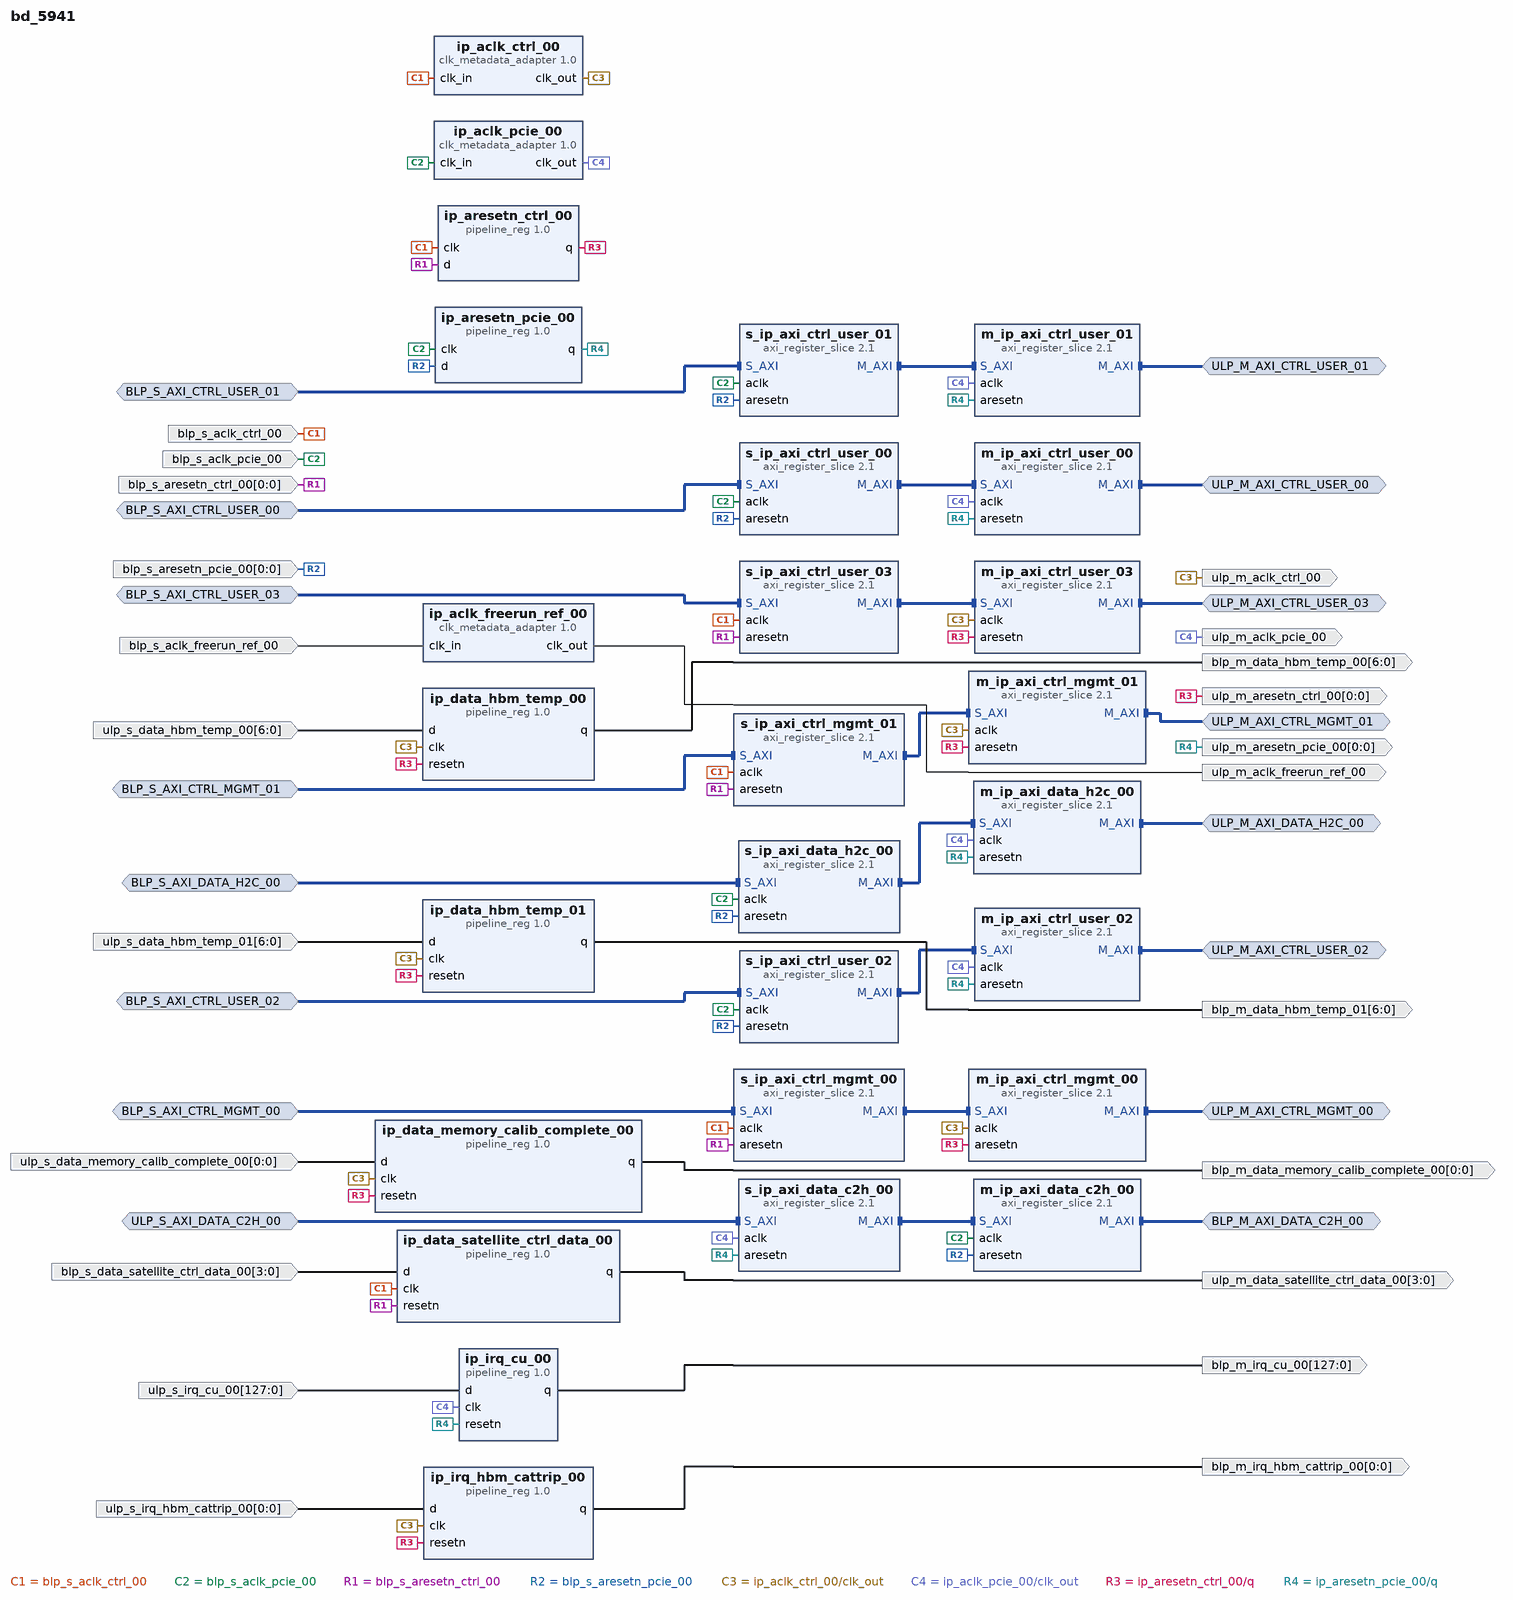
[diagram p0: block diagram of the top level]
# Vivado block design bd_5941, xcu55c-fsvh2892-2L-e, Vivado 2023.2
create_bd_design bd_5941

create_bd_intf_port -mode Slave -vlnv xilinx.com:interface:aximm_rtl:1.0 BLP_S_AXI_CTRL_MGMT_00
set_property -dict [list \
  CONFIG.ADDR_WIDTH 25 \
  CONFIG.ARUSER_WIDTH 0 \
  CONFIG.AWUSER_WIDTH 0 \
  CONFIG.BUSER_WIDTH 0 \
  CONFIG.CLK_DOMAIN cd_ctrl_00 \
  CONFIG.DATA_WIDTH 32 \
  CONFIG.FREQ_HZ 50000000 \
  CONFIG.NUM_READ_OUTSTANDING 2 \
  CONFIG.NUM_WRITE_OUTSTANDING 2 \
  CONFIG.PHASE 0 \
  CONFIG.PROTOCOL AXI4LITE \
  CONFIG.READ_WRITE_MODE READ_WRITE \
  CONFIG.RUSER_WIDTH 0 \
  CONFIG.SLR_ASSIGNMENT slr0 \
  CONFIG.WUSER_WIDTH 0 \
] [get_bd_intf_ports BLP_S_AXI_CTRL_MGMT_00]
create_bd_intf_port -mode Master -vlnv xilinx.com:interface:aximm_rtl:1.0 ULP_M_AXI_CTRL_MGMT_00
set_property -dict [list \
  CONFIG.ADDR_WIDTH 25 \
  CONFIG.ARUSER_WIDTH 0 \
  CONFIG.AWUSER_WIDTH 0 \
  CONFIG.BUSER_WIDTH 0 \
  CONFIG.CLK_DOMAIN cd_ctrl_00 \
  CONFIG.DATA_WIDTH 32 \
  CONFIG.FREQ_HZ 50000000 \
  CONFIG.NUM_READ_OUTSTANDING 2 \
  CONFIG.NUM_WRITE_OUTSTANDING 2 \
  CONFIG.PHASE 0 \
  CONFIG.PROTOCOL AXI4LITE \
  CONFIG.READ_WRITE_MODE READ_WRITE \
  CONFIG.RUSER_WIDTH 0 \
  CONFIG.SLR_ASSIGNMENT slr0 \
  CONFIG.WUSER_WIDTH 0 \
] [get_bd_intf_ports ULP_M_AXI_CTRL_MGMT_00]
create_bd_intf_port -mode Slave -vlnv xilinx.com:interface:aximm_rtl:1.0 BLP_S_AXI_CTRL_MGMT_01
set_property -dict [list \
  CONFIG.ADDR_WIDTH 25 \
  CONFIG.ARUSER_WIDTH 0 \
  CONFIG.AWUSER_WIDTH 0 \
  CONFIG.BUSER_WIDTH 0 \
  CONFIG.CLK_DOMAIN cd_ctrl_00 \
  CONFIG.DATA_WIDTH 32 \
  CONFIG.FREQ_HZ 50000000 \
  CONFIG.NUM_READ_OUTSTANDING 2 \
  CONFIG.NUM_WRITE_OUTSTANDING 2 \
  CONFIG.PHASE 0 \
  CONFIG.PROTOCOL AXI4LITE \
  CONFIG.READ_WRITE_MODE READ_WRITE \
  CONFIG.RUSER_WIDTH 0 \
  CONFIG.SLR_ASSIGNMENT slr2 \
  CONFIG.WUSER_WIDTH 0 \
] [get_bd_intf_ports BLP_S_AXI_CTRL_MGMT_01]
create_bd_intf_port -mode Master -vlnv xilinx.com:interface:aximm_rtl:1.0 ULP_M_AXI_CTRL_MGMT_01
set_property -dict [list \
  CONFIG.ADDR_WIDTH 25 \
  CONFIG.ARUSER_WIDTH 0 \
  CONFIG.AWUSER_WIDTH 0 \
  CONFIG.BUSER_WIDTH 0 \
  CONFIG.CLK_DOMAIN cd_ctrl_00 \
  CONFIG.DATA_WIDTH 32 \
  CONFIG.FREQ_HZ 50000000 \
  CONFIG.NUM_READ_OUTSTANDING 2 \
  CONFIG.NUM_WRITE_OUTSTANDING 2 \
  CONFIG.PHASE 0 \
  CONFIG.PROTOCOL AXI4LITE \
  CONFIG.READ_WRITE_MODE READ_WRITE \
  CONFIG.RUSER_WIDTH 0 \
  CONFIG.SLR_ASSIGNMENT slr2 \
  CONFIG.WUSER_WIDTH 0 \
] [get_bd_intf_ports ULP_M_AXI_CTRL_MGMT_01]
create_bd_intf_port -mode Slave -vlnv xilinx.com:interface:aximm_rtl:1.0 BLP_S_AXI_CTRL_USER_00
set_property -dict [list \
  CONFIG.ADDR_WIDTH 25 \
  CONFIG.ARUSER_WIDTH 0 \
  CONFIG.AWUSER_WIDTH 0 \
  CONFIG.BUSER_WIDTH 0 \
  CONFIG.CLK_DOMAIN cd_pcie_00 \
  CONFIG.DATA_WIDTH 32 \
  CONFIG.FREQ_HZ 250000000 \
  CONFIG.NUM_READ_OUTSTANDING 2 \
  CONFIG.NUM_WRITE_OUTSTANDING 2 \
  CONFIG.PHASE 0 \
  CONFIG.PROTOCOL AXI4LITE \
  CONFIG.READ_WRITE_MODE READ_WRITE \
  CONFIG.RUSER_WIDTH 0 \
  CONFIG.SLR_ASSIGNMENT slr0 \
  CONFIG.WUSER_WIDTH 0 \
] [get_bd_intf_ports BLP_S_AXI_CTRL_USER_00]
create_bd_intf_port -mode Master -vlnv xilinx.com:interface:aximm_rtl:1.0 ULP_M_AXI_CTRL_USER_00
set_property -dict [list \
  CONFIG.ADDR_WIDTH 25 \
  CONFIG.ARUSER_WIDTH 0 \
  CONFIG.AWUSER_WIDTH 0 \
  CONFIG.BUSER_WIDTH 0 \
  CONFIG.CLK_DOMAIN cd_pcie_00 \
  CONFIG.DATA_WIDTH 32 \
  CONFIG.FREQ_HZ 250000000 \
  CONFIG.NUM_READ_OUTSTANDING 2 \
  CONFIG.NUM_WRITE_OUTSTANDING 2 \
  CONFIG.PHASE 0 \
  CONFIG.PROTOCOL AXI4LITE \
  CONFIG.READ_WRITE_MODE READ_WRITE \
  CONFIG.RUSER_WIDTH 0 \
  CONFIG.SLR_ASSIGNMENT slr0 \
  CONFIG.WUSER_WIDTH 0 \
] [get_bd_intf_ports ULP_M_AXI_CTRL_USER_00]
create_bd_intf_port -mode Slave -vlnv xilinx.com:interface:aximm_rtl:1.0 BLP_S_AXI_CTRL_USER_01
set_property -dict [list \
  CONFIG.ADDR_WIDTH 25 \
  CONFIG.ARUSER_WIDTH 0 \
  CONFIG.AWUSER_WIDTH 0 \
  CONFIG.BUSER_WIDTH 0 \
  CONFIG.CLK_DOMAIN cd_pcie_00 \
  CONFIG.DATA_WIDTH 32 \
  CONFIG.FREQ_HZ 250000000 \
  CONFIG.NUM_READ_OUTSTANDING 2 \
  CONFIG.NUM_WRITE_OUTSTANDING 2 \
  CONFIG.PHASE 0 \
  CONFIG.PROTOCOL AXI4LITE \
  CONFIG.READ_WRITE_MODE READ_WRITE \
  CONFIG.RUSER_WIDTH 0 \
  CONFIG.SLR_ASSIGNMENT slr1 \
  CONFIG.WUSER_WIDTH 0 \
] [get_bd_intf_ports BLP_S_AXI_CTRL_USER_01]
create_bd_intf_port -mode Master -vlnv xilinx.com:interface:aximm_rtl:1.0 ULP_M_AXI_CTRL_USER_01
set_property -dict [list \
  CONFIG.ADDR_WIDTH 25 \
  CONFIG.ARUSER_WIDTH 0 \
  CONFIG.AWUSER_WIDTH 0 \
  CONFIG.BUSER_WIDTH 0 \
  CONFIG.CLK_DOMAIN cd_pcie_00 \
  CONFIG.DATA_WIDTH 32 \
  CONFIG.FREQ_HZ 250000000 \
  CONFIG.NUM_READ_OUTSTANDING 2 \
  CONFIG.NUM_WRITE_OUTSTANDING 2 \
  CONFIG.PHASE 0 \
  CONFIG.PROTOCOL AXI4LITE \
  CONFIG.READ_WRITE_MODE READ_WRITE \
  CONFIG.RUSER_WIDTH 0 \
  CONFIG.SLR_ASSIGNMENT slr1 \
  CONFIG.WUSER_WIDTH 0 \
] [get_bd_intf_ports ULP_M_AXI_CTRL_USER_01]
create_bd_intf_port -mode Slave -vlnv xilinx.com:interface:aximm_rtl:1.0 BLP_S_AXI_CTRL_USER_02
set_property -dict [list \
  CONFIG.ADDR_WIDTH 25 \
  CONFIG.ARUSER_WIDTH 0 \
  CONFIG.AWUSER_WIDTH 0 \
  CONFIG.BUSER_WIDTH 0 \
  CONFIG.CLK_DOMAIN cd_pcie_00 \
  CONFIG.DATA_WIDTH 32 \
  CONFIG.FREQ_HZ 250000000 \
  CONFIG.NUM_READ_OUTSTANDING 2 \
  CONFIG.NUM_WRITE_OUTSTANDING 2 \
  CONFIG.PHASE 0 \
  CONFIG.PROTOCOL AXI4LITE \
  CONFIG.READ_WRITE_MODE READ_WRITE \
  CONFIG.RUSER_WIDTH 0 \
  CONFIG.SLR_ASSIGNMENT slr2 \
  CONFIG.WUSER_WIDTH 0 \
] [get_bd_intf_ports BLP_S_AXI_CTRL_USER_02]
create_bd_intf_port -mode Master -vlnv xilinx.com:interface:aximm_rtl:1.0 ULP_M_AXI_CTRL_USER_02
set_property -dict [list \
  CONFIG.ADDR_WIDTH 25 \
  CONFIG.ARUSER_WIDTH 0 \
  CONFIG.AWUSER_WIDTH 0 \
  CONFIG.BUSER_WIDTH 0 \
  CONFIG.CLK_DOMAIN cd_pcie_00 \
  CONFIG.DATA_WIDTH 32 \
  CONFIG.FREQ_HZ 250000000 \
  CONFIG.NUM_READ_OUTSTANDING 2 \
  CONFIG.NUM_WRITE_OUTSTANDING 2 \
  CONFIG.PHASE 0 \
  CONFIG.PROTOCOL AXI4LITE \
  CONFIG.READ_WRITE_MODE READ_WRITE \
  CONFIG.RUSER_WIDTH 0 \
  CONFIG.SLR_ASSIGNMENT slr2 \
  CONFIG.WUSER_WIDTH 0 \
] [get_bd_intf_ports ULP_M_AXI_CTRL_USER_02]
create_bd_intf_port -mode Slave -vlnv xilinx.com:interface:aximm_rtl:1.0 BLP_S_AXI_CTRL_USER_03
set_property -dict [list \
  CONFIG.ADDR_WIDTH 25 \
  CONFIG.ARUSER_WIDTH 0 \
  CONFIG.AWUSER_WIDTH 0 \
  CONFIG.BUSER_WIDTH 0 \
  CONFIG.CLK_DOMAIN cd_ctrl_00 \
  CONFIG.DATA_WIDTH 32 \
  CONFIG.FREQ_HZ 50000000 \
  CONFIG.NUM_READ_OUTSTANDING 2 \
  CONFIG.NUM_WRITE_OUTSTANDING 2 \
  CONFIG.PHASE 0 \
  CONFIG.PROTOCOL AXI4LITE \
  CONFIG.READ_WRITE_MODE READ_WRITE \
  CONFIG.RUSER_WIDTH 0 \
  CONFIG.SLR_ASSIGNMENT slr2 \
  CONFIG.WUSER_WIDTH 0 \
] [get_bd_intf_ports BLP_S_AXI_CTRL_USER_03]
create_bd_intf_port -mode Master -vlnv xilinx.com:interface:aximm_rtl:1.0 ULP_M_AXI_CTRL_USER_03
set_property -dict [list \
  CONFIG.ADDR_WIDTH 25 \
  CONFIG.ARUSER_WIDTH 0 \
  CONFIG.AWUSER_WIDTH 0 \
  CONFIG.BUSER_WIDTH 0 \
  CONFIG.CLK_DOMAIN cd_ctrl_00 \
  CONFIG.DATA_WIDTH 32 \
  CONFIG.FREQ_HZ 50000000 \
  CONFIG.NUM_READ_OUTSTANDING 2 \
  CONFIG.NUM_WRITE_OUTSTANDING 2 \
  CONFIG.PHASE 0 \
  CONFIG.PROTOCOL AXI4LITE \
  CONFIG.READ_WRITE_MODE READ_WRITE \
  CONFIG.RUSER_WIDTH 0 \
  CONFIG.SLR_ASSIGNMENT slr2 \
  CONFIG.WUSER_WIDTH 0 \
] [get_bd_intf_ports ULP_M_AXI_CTRL_USER_03]
create_bd_intf_port -mode Slave -vlnv xilinx.com:interface:aximm_rtl:1.0 ULP_S_AXI_DATA_C2H_00
set_property -dict [list \
  CONFIG.ADDR_WIDTH 39 \
  CONFIG.ARUSER_WIDTH 0 \
  CONFIG.AWUSER_WIDTH 0 \
  CONFIG.BUSER_WIDTH 0 \
  CONFIG.CLK_DOMAIN cd_pcie_00 \
  CONFIG.DATA_WIDTH 512 \
  CONFIG.FREQ_HZ 250000000 \
  CONFIG.HAS_BRESP 1 \
  CONFIG.HAS_BURST 1 \
  CONFIG.HAS_CACHE 0 \
  CONFIG.HAS_LOCK 0 \
  CONFIG.HAS_PROT 0 \
  CONFIG.HAS_QOS 0 \
  CONFIG.HAS_REGION 0 \
  CONFIG.HAS_RRESP 1 \
  CONFIG.HAS_WSTRB 1 \
  CONFIG.ID_WIDTH 2 \
  CONFIG.MAX_BURST_LENGTH 256 \
  CONFIG.NUM_READ_OUTSTANDING 64 \
  CONFIG.NUM_READ_THREADS 2 \
  CONFIG.NUM_WRITE_OUTSTANDING 32 \
  CONFIG.NUM_WRITE_THREADS 2 \
  CONFIG.PHASE 0 \
  CONFIG.PROTOCOL AXI4 \
  CONFIG.READ_WRITE_MODE READ_WRITE \
  CONFIG.RUSER_BITS_PER_BYTE 0 \
  CONFIG.RUSER_WIDTH 0 \
  CONFIG.SLR_ASSIGNMENT slr2 \
  CONFIG.SUPPORTS_NARROW_BURST 0 \
  CONFIG.WUSER_BITS_PER_BYTE 0 \
  CONFIG.WUSER_WIDTH 0 \
] [get_bd_intf_ports ULP_S_AXI_DATA_C2H_00]
create_bd_intf_port -mode Master -vlnv xilinx.com:interface:aximm_rtl:1.0 BLP_M_AXI_DATA_C2H_00
set_property -dict [list \
  CONFIG.ADDR_WIDTH 39 \
  CONFIG.ARUSER_WIDTH 0 \
  CONFIG.AWUSER_WIDTH 0 \
  CONFIG.BUSER_WIDTH 0 \
  CONFIG.CLK_DOMAIN cd_pcie_00 \
  CONFIG.DATA_WIDTH 512 \
  CONFIG.FREQ_HZ 250000000 \
  CONFIG.HAS_BRESP 1 \
  CONFIG.HAS_BURST 1 \
  CONFIG.HAS_CACHE 0 \
  CONFIG.HAS_LOCK 0 \
  CONFIG.HAS_PROT 0 \
  CONFIG.HAS_QOS 0 \
  CONFIG.HAS_REGION 0 \
  CONFIG.HAS_RRESP 1 \
  CONFIG.HAS_WSTRB 1 \
  CONFIG.ID_WIDTH 2 \
  CONFIG.MAX_BURST_LENGTH 256 \
  CONFIG.NUM_READ_OUTSTANDING 64 \
  CONFIG.NUM_READ_THREADS 2 \
  CONFIG.NUM_WRITE_OUTSTANDING 32 \
  CONFIG.NUM_WRITE_THREADS 2 \
  CONFIG.PHASE 0 \
  CONFIG.PROTOCOL AXI4 \
  CONFIG.READ_WRITE_MODE READ_WRITE \
  CONFIG.RUSER_BITS_PER_BYTE 0 \
  CONFIG.RUSER_WIDTH 0 \
  CONFIG.SLR_ASSIGNMENT slr2 \
  CONFIG.SUPPORTS_NARROW_BURST 0 \
  CONFIG.WUSER_BITS_PER_BYTE 0 \
  CONFIG.WUSER_WIDTH 0 \
] [get_bd_intf_ports BLP_M_AXI_DATA_C2H_00]
create_bd_intf_port -mode Slave -vlnv xilinx.com:interface:aximm_rtl:1.0 BLP_S_AXI_DATA_H2C_00
set_property -dict [list \
  CONFIG.ADDR_WIDTH 39 \
  CONFIG.ARUSER_WIDTH 0 \
  CONFIG.AWUSER_WIDTH 0 \
  CONFIG.BUSER_WIDTH 0 \
  CONFIG.CLK_DOMAIN cd_pcie_00 \
  CONFIG.DATA_WIDTH 512 \
  CONFIG.FREQ_HZ 250000000 \
  CONFIG.HAS_BRESP 1 \
  CONFIG.HAS_BURST 0 \
  CONFIG.HAS_CACHE 0 \
  CONFIG.HAS_LOCK 0 \
  CONFIG.HAS_PROT 0 \
  CONFIG.HAS_QOS 0 \
  CONFIG.HAS_REGION 0 \
  CONFIG.HAS_RRESP 1 \
  CONFIG.HAS_WSTRB 1 \
  CONFIG.ID_WIDTH 4 \
  CONFIG.MAX_BURST_LENGTH 64 \
  CONFIG.NUM_READ_OUTSTANDING 16 \
  CONFIG.NUM_READ_THREADS 2 \
  CONFIG.NUM_WRITE_OUTSTANDING 32 \
  CONFIG.NUM_WRITE_THREADS 2 \
  CONFIG.PHASE 0 \
  CONFIG.PROTOCOL AXI4 \
  CONFIG.READ_WRITE_MODE READ_WRITE \
  CONFIG.RUSER_BITS_PER_BYTE 0 \
  CONFIG.RUSER_WIDTH 0 \
  CONFIG.SLR_ASSIGNMENT slr2 \
  CONFIG.SUPPORTS_NARROW_BURST 0 \
  CONFIG.WUSER_BITS_PER_BYTE 0 \
  CONFIG.WUSER_WIDTH 0 \
] [get_bd_intf_ports BLP_S_AXI_DATA_H2C_00]
create_bd_intf_port -mode Master -vlnv xilinx.com:interface:aximm_rtl:1.0 ULP_M_AXI_DATA_H2C_00
set_property -dict [list \
  CONFIG.ADDR_WIDTH 39 \
  CONFIG.ARUSER_WIDTH 0 \
  CONFIG.AWUSER_WIDTH 0 \
  CONFIG.BUSER_WIDTH 0 \
  CONFIG.CLK_DOMAIN cd_pcie_00 \
  CONFIG.DATA_WIDTH 512 \
  CONFIG.FREQ_HZ 250000000 \
  CONFIG.HAS_BRESP 1 \
  CONFIG.HAS_BURST 0 \
  CONFIG.HAS_CACHE 0 \
  CONFIG.HAS_LOCK 0 \
  CONFIG.HAS_PROT 0 \
  CONFIG.HAS_QOS 0 \
  CONFIG.HAS_REGION 0 \
  CONFIG.HAS_RRESP 1 \
  CONFIG.HAS_WSTRB 1 \
  CONFIG.ID_WIDTH 4 \
  CONFIG.MAX_BURST_LENGTH 64 \
  CONFIG.NUM_READ_OUTSTANDING 16 \
  CONFIG.NUM_READ_THREADS 2 \
  CONFIG.NUM_WRITE_OUTSTANDING 32 \
  CONFIG.NUM_WRITE_THREADS 2 \
  CONFIG.PHASE 0 \
  CONFIG.PROTOCOL AXI4 \
  CONFIG.READ_WRITE_MODE READ_WRITE \
  CONFIG.RUSER_BITS_PER_BYTE 0 \
  CONFIG.RUSER_WIDTH 0 \
  CONFIG.SLR_ASSIGNMENT slr2 \
  CONFIG.SUPPORTS_NARROW_BURST 0 \
  CONFIG.WUSER_BITS_PER_BYTE 0 \
  CONFIG.WUSER_WIDTH 0 \
] [get_bd_intf_ports ULP_M_AXI_DATA_H2C_00]
create_bd_port -dir I -type clk blp_s_aclk_ctrl_00
set_property -dict [list \
  CONFIG.ASSOCIATED_RESET BLP_S_ARESETN_CTRL_00 \
  CONFIG.CLK_DOMAIN cd_ctrl_00 \
  CONFIG.FREQ_HZ 50000000 \
  CONFIG.PHASE 0 \
] [get_bd_ports blp_s_aclk_ctrl_00]
create_bd_port -dir O -type clk ulp_m_aclk_ctrl_00
set_property -dict [list \
  CONFIG.ASSOCIATED_RESET ULP_M_ARESETN_CTRL_00 \
  CONFIG.CLK_DOMAIN cd_ctrl_00 \
  CONFIG.FREQ_HZ 50000000 \
  CONFIG.PHASE 0 \
] [get_bd_ports ulp_m_aclk_ctrl_00]
create_bd_port -dir I -type clk blp_s_aclk_pcie_00
set_property -dict [list \
  CONFIG.ASSOCIATED_RESET BLP_S_ARESETN_PCIE_00 \
  CONFIG.CLK_DOMAIN cd_pcie_00 \
  CONFIG.FREQ_HZ 250000000 \
  CONFIG.PHASE 0 \
] [get_bd_ports blp_s_aclk_pcie_00]
create_bd_port -dir O -type clk ulp_m_aclk_pcie_00
set_property -dict [list \
  CONFIG.ASSOCIATED_RESET ULP_M_ARESETN_PCIE_00 \
  CONFIG.CLK_DOMAIN cd_pcie_00 \
  CONFIG.FREQ_HZ 250000000 \
  CONFIG.PHASE 0 \
] [get_bd_ports ulp_m_aclk_pcie_00]
create_bd_port -dir I -type clk blp_s_aclk_freerun_ref_00
set_property -dict [list \
  CONFIG.CLK_DOMAIN cd_freerun_ref_00 \
  CONFIG.FREQ_HZ 100000000 \
  CONFIG.PHASE 0 \
] [get_bd_ports blp_s_aclk_freerun_ref_00]
create_bd_port -dir O -type clk ulp_m_aclk_freerun_ref_00
set_property -dict [list \
  CONFIG.CLK_DOMAIN cd_freerun_ref_00 \
  CONFIG.FREQ_HZ 100000000 \
  CONFIG.PHASE 0 \
] [get_bd_ports ulp_m_aclk_freerun_ref_00]
create_bd_port -dir I -from 0 -to 0 -type rst blp_s_aresetn_ctrl_00
set_property -dict {CONFIG.POLARITY ACTIVE_LOW} [get_bd_ports blp_s_aresetn_ctrl_00]
create_bd_port -dir O -from 0 -to 0 -type rst ulp_m_aresetn_ctrl_00
set_property -dict {CONFIG.POLARITY ACTIVE_LOW} [get_bd_ports ulp_m_aresetn_ctrl_00]
create_bd_port -dir I -from 0 -to 0 -type rst blp_s_aresetn_pcie_00
set_property -dict {CONFIG.POLARITY ACTIVE_LOW} [get_bd_ports blp_s_aresetn_pcie_00]
create_bd_port -dir O -from 0 -to 0 -type rst ulp_m_aresetn_pcie_00
set_property -dict {CONFIG.POLARITY ACTIVE_LOW} [get_bd_ports ulp_m_aresetn_pcie_00]
create_bd_port -dir I -from 3 -to 0 -type data blp_s_data_satellite_ctrl_data_00
create_bd_port -dir O -from 3 -to 0 -type data ulp_m_data_satellite_ctrl_data_00
create_bd_port -dir I -from 0 -to 0 -type data ulp_s_data_memory_calib_complete_00
create_bd_port -dir O -from 0 -to 0 -type data blp_m_data_memory_calib_complete_00
create_bd_port -dir I -from 6 -to 0 -type data ulp_s_data_hbm_temp_00
create_bd_port -dir O -from 6 -to 0 -type data blp_m_data_hbm_temp_00
create_bd_port -dir I -from 6 -to 0 -type data ulp_s_data_hbm_temp_01
create_bd_port -dir O -from 6 -to 0 -type data blp_m_data_hbm_temp_01
create_bd_port -dir I -from 127 -to 0 -type intr ulp_s_irq_cu_00
set_property -dict {CONFIG.PortWidth 128 CONFIG.SENSITIVITY level_high} [get_bd_ports ulp_s_irq_cu_00]
create_bd_port -dir O -from 127 -to 0 -type intr blp_m_irq_cu_00
set_property -dict {CONFIG.SENSITIVITY level_high} [get_bd_ports blp_m_irq_cu_00]
create_bd_port -dir I -from 0 -to 0 -type intr ulp_s_irq_hbm_cattrip_00
set_property -dict {CONFIG.PortWidth 1 CONFIG.SENSITIVITY level_high} [get_bd_ports ulp_s_irq_hbm_cattrip_00]
create_bd_port -dir O -from 0 -to 0 -type intr blp_m_irq_hbm_cattrip_00
set_property -dict {CONFIG.SENSITIVITY level_high} [get_bd_ports blp_m_irq_hbm_cattrip_00]

create_bd_cell -type ip -vlnv xilinx.com:ip:clk_metadata_adapter:1.0 ip_aclk_ctrl_00
create_bd_cell -type ip -vlnv xilinx.com:ip:clk_metadata_adapter:1.0 ip_aclk_pcie_00
create_bd_cell -type ip -vlnv xilinx.com:ip:clk_metadata_adapter:1.0 ip_aclk_freerun_ref_00
create_bd_cell -type ip -vlnv xilinx.com:ip:pipeline_reg:1.0 ip_aresetn_ctrl_00
set_property -dict {CONFIG.DEPTH 0} [get_bd_cells ip_aresetn_ctrl_00]
create_bd_cell -type ip -vlnv xilinx.com:ip:pipeline_reg:1.0 ip_aresetn_pcie_00
set_property -dict {CONFIG.DEPTH 0} [get_bd_cells ip_aresetn_pcie_00]
create_bd_cell -type ip -vlnv xilinx.com:ip:axi_register_slice:2.1 s_ip_axi_ctrl_mgmt_00
set_property -dict [list \
  CONFIG.ADDR_WIDTH 25 \
  CONFIG.DATA_WIDTH 32 \
  CONFIG.NUM_READ_OUTSTANDING 2 \
  CONFIG.NUM_WRITE_OUTSTANDING 2 \
  CONFIG.PROTOCOL AXI4LITE \
  CONFIG.READ_WRITE_MODE READ_WRITE \
  CONFIG.REG_AR 0 \
  CONFIG.REG_AW 0 \
  CONFIG.REG_B 0 \
  CONFIG.REG_R 0 \
  CONFIG.REG_W 0 \
] [get_bd_cells s_ip_axi_ctrl_mgmt_00]
create_bd_cell -type ip -vlnv xilinx.com:ip:axi_register_slice:2.1 m_ip_axi_ctrl_mgmt_00
set_property -dict [list \
  CONFIG.ADDR_WIDTH 25 \
  CONFIG.DATA_WIDTH 32 \
  CONFIG.NUM_READ_OUTSTANDING 2 \
  CONFIG.NUM_WRITE_OUTSTANDING 2 \
  CONFIG.PROTOCOL AXI4LITE \
  CONFIG.READ_WRITE_MODE READ_WRITE \
  CONFIG.REG_AR 0 \
  CONFIG.REG_AW 0 \
  CONFIG.REG_B 0 \
  CONFIG.REG_R 0 \
  CONFIG.REG_W 0 \
] [get_bd_cells m_ip_axi_ctrl_mgmt_00]
create_bd_cell -type ip -vlnv xilinx.com:ip:axi_register_slice:2.1 s_ip_axi_ctrl_mgmt_01
set_property -dict [list \
  CONFIG.ADDR_WIDTH 25 \
  CONFIG.DATA_WIDTH 32 \
  CONFIG.NUM_READ_OUTSTANDING 2 \
  CONFIG.NUM_WRITE_OUTSTANDING 2 \
  CONFIG.PROTOCOL AXI4LITE \
  CONFIG.READ_WRITE_MODE READ_WRITE \
  CONFIG.REG_AR 0 \
  CONFIG.REG_AW 0 \
  CONFIG.REG_B 0 \
  CONFIG.REG_R 0 \
  CONFIG.REG_W 0 \
] [get_bd_cells s_ip_axi_ctrl_mgmt_01]
create_bd_cell -type ip -vlnv xilinx.com:ip:axi_register_slice:2.1 m_ip_axi_ctrl_mgmt_01
set_property -dict [list \
  CONFIG.ADDR_WIDTH 25 \
  CONFIG.DATA_WIDTH 32 \
  CONFIG.NUM_READ_OUTSTANDING 2 \
  CONFIG.NUM_WRITE_OUTSTANDING 2 \
  CONFIG.PROTOCOL AXI4LITE \
  CONFIG.READ_WRITE_MODE READ_WRITE \
  CONFIG.REG_AR 0 \
  CONFIG.REG_AW 0 \
  CONFIG.REG_B 0 \
  CONFIG.REG_R 0 \
  CONFIG.REG_W 0 \
] [get_bd_cells m_ip_axi_ctrl_mgmt_01]
create_bd_cell -type ip -vlnv xilinx.com:ip:axi_register_slice:2.1 s_ip_axi_ctrl_user_00
set_property -dict [list \
  CONFIG.ADDR_WIDTH 25 \
  CONFIG.DATA_WIDTH 32 \
  CONFIG.NUM_READ_OUTSTANDING 2 \
  CONFIG.NUM_WRITE_OUTSTANDING 2 \
  CONFIG.PROTOCOL AXI4LITE \
  CONFIG.READ_WRITE_MODE READ_WRITE \
  CONFIG.REG_AR 0 \
  CONFIG.REG_AW 0 \
  CONFIG.REG_B 0 \
  CONFIG.REG_R 0 \
  CONFIG.REG_W 0 \
] [get_bd_cells s_ip_axi_ctrl_user_00]
create_bd_cell -type ip -vlnv xilinx.com:ip:axi_register_slice:2.1 m_ip_axi_ctrl_user_00
set_property -dict [list \
  CONFIG.ADDR_WIDTH 25 \
  CONFIG.DATA_WIDTH 32 \
  CONFIG.NUM_READ_OUTSTANDING 2 \
  CONFIG.NUM_WRITE_OUTSTANDING 2 \
  CONFIG.PROTOCOL AXI4LITE \
  CONFIG.READ_WRITE_MODE READ_WRITE \
  CONFIG.REG_AR 0 \
  CONFIG.REG_AW 0 \
  CONFIG.REG_B 0 \
  CONFIG.REG_R 0 \
  CONFIG.REG_W 0 \
] [get_bd_cells m_ip_axi_ctrl_user_00]
create_bd_cell -type ip -vlnv xilinx.com:ip:axi_register_slice:2.1 s_ip_axi_ctrl_user_01
set_property -dict [list \
  CONFIG.ADDR_WIDTH 25 \
  CONFIG.DATA_WIDTH 32 \
  CONFIG.NUM_READ_OUTSTANDING 2 \
  CONFIG.NUM_WRITE_OUTSTANDING 2 \
  CONFIG.PROTOCOL AXI4LITE \
  CONFIG.READ_WRITE_MODE READ_WRITE \
  CONFIG.REG_AR 0 \
  CONFIG.REG_AW 0 \
  CONFIG.REG_B 0 \
  CONFIG.REG_R 0 \
  CONFIG.REG_W 0 \
] [get_bd_cells s_ip_axi_ctrl_user_01]
create_bd_cell -type ip -vlnv xilinx.com:ip:axi_register_slice:2.1 m_ip_axi_ctrl_user_01
set_property -dict [list \
  CONFIG.ADDR_WIDTH 25 \
  CONFIG.DATA_WIDTH 32 \
  CONFIG.NUM_READ_OUTSTANDING 2 \
  CONFIG.NUM_WRITE_OUTSTANDING 2 \
  CONFIG.PROTOCOL AXI4LITE \
  CONFIG.READ_WRITE_MODE READ_WRITE \
  CONFIG.REG_AR 0 \
  CONFIG.REG_AW 0 \
  CONFIG.REG_B 0 \
  CONFIG.REG_R 0 \
  CONFIG.REG_W 0 \
] [get_bd_cells m_ip_axi_ctrl_user_01]
create_bd_cell -type ip -vlnv xilinx.com:ip:axi_register_slice:2.1 s_ip_axi_ctrl_user_02
set_property -dict [list \
  CONFIG.ADDR_WIDTH 25 \
  CONFIG.DATA_WIDTH 32 \
  CONFIG.NUM_READ_OUTSTANDING 2 \
  CONFIG.NUM_WRITE_OUTSTANDING 2 \
  CONFIG.PROTOCOL AXI4LITE \
  CONFIG.READ_WRITE_MODE READ_WRITE \
  CONFIG.REG_AR 0 \
  CONFIG.REG_AW 0 \
  CONFIG.REG_B 0 \
  CONFIG.REG_R 0 \
  CONFIG.REG_W 0 \
] [get_bd_cells s_ip_axi_ctrl_user_02]
create_bd_cell -type ip -vlnv xilinx.com:ip:axi_register_slice:2.1 m_ip_axi_ctrl_user_02
set_property -dict [list \
  CONFIG.ADDR_WIDTH 25 \
  CONFIG.DATA_WIDTH 32 \
  CONFIG.NUM_READ_OUTSTANDING 2 \
  CONFIG.NUM_WRITE_OUTSTANDING 2 \
  CONFIG.PROTOCOL AXI4LITE \
  CONFIG.READ_WRITE_MODE READ_WRITE \
  CONFIG.REG_AR 0 \
  CONFIG.REG_AW 0 \
  CONFIG.REG_B 0 \
  CONFIG.REG_R 0 \
  CONFIG.REG_W 0 \
] [get_bd_cells m_ip_axi_ctrl_user_02]
create_bd_cell -type ip -vlnv xilinx.com:ip:axi_register_slice:2.1 s_ip_axi_ctrl_user_03
set_property -dict [list \
  CONFIG.ADDR_WIDTH 25 \
  CONFIG.DATA_WIDTH 32 \
  CONFIG.NUM_READ_OUTSTANDING 2 \
  CONFIG.NUM_WRITE_OUTSTANDING 2 \
  CONFIG.PROTOCOL AXI4LITE \
  CONFIG.READ_WRITE_MODE READ_WRITE \
  CONFIG.REG_AR 0 \
  CONFIG.REG_AW 0 \
  CONFIG.REG_B 0 \
  CONFIG.REG_R 0 \
  CONFIG.REG_W 0 \
] [get_bd_cells s_ip_axi_ctrl_user_03]
create_bd_cell -type ip -vlnv xilinx.com:ip:axi_register_slice:2.1 m_ip_axi_ctrl_user_03
set_property -dict [list \
  CONFIG.ADDR_WIDTH 25 \
  CONFIG.DATA_WIDTH 32 \
  CONFIG.NUM_READ_OUTSTANDING 2 \
  CONFIG.NUM_WRITE_OUTSTANDING 2 \
  CONFIG.PROTOCOL AXI4LITE \
  CONFIG.READ_WRITE_MODE READ_WRITE \
  CONFIG.REG_AR 0 \
  CONFIG.REG_AW 0 \
  CONFIG.REG_B 0 \
  CONFIG.REG_R 0 \
  CONFIG.REG_W 0 \
] [get_bd_cells m_ip_axi_ctrl_user_03]
create_bd_cell -type ip -vlnv xilinx.com:ip:axi_register_slice:2.1 s_ip_axi_data_c2h_00
set_property -dict [list \
  CONFIG.ADDR_WIDTH 39 \
  CONFIG.ARUSER_WIDTH 0 \
  CONFIG.AWUSER_WIDTH 0 \
  CONFIG.BUSER_WIDTH 0 \
  CONFIG.DATA_WIDTH 512 \
  CONFIG.HAS_BRESP 1 \
  CONFIG.HAS_BURST 1 \
  CONFIG.HAS_CACHE 0 \
  CONFIG.HAS_LOCK 0 \
  CONFIG.HAS_PROT 0 \
  CONFIG.HAS_QOS 0 \
  CONFIG.HAS_REGION 0 \
  CONFIG.HAS_RRESP 1 \
  CONFIG.HAS_WSTRB 1 \
  CONFIG.ID_WIDTH 2 \
  CONFIG.MAX_BURST_LENGTH 256 \
  CONFIG.NUM_READ_OUTSTANDING 64 \
  CONFIG.NUM_READ_THREADS 2 \
  CONFIG.NUM_WRITE_OUTSTANDING 32 \
  CONFIG.NUM_WRITE_THREADS 2 \
  CONFIG.PROTOCOL AXI4 \
  CONFIG.READ_WRITE_MODE READ_WRITE \
  CONFIG.REG_AR 0 \
  CONFIG.REG_AW 0 \
  CONFIG.REG_B 0 \
  CONFIG.REG_R 0 \
  CONFIG.REG_W 0 \
  CONFIG.RUSER_BITS_PER_BYTE 0 \
  CONFIG.RUSER_WIDTH 0 \
  CONFIG.SUPPORTS_NARROW_BURST 0 \
  CONFIG.WUSER_BITS_PER_BYTE 0 \
  CONFIG.WUSER_WIDTH 0 \
] [get_bd_cells s_ip_axi_data_c2h_00]
create_bd_cell -type ip -vlnv xilinx.com:ip:axi_register_slice:2.1 m_ip_axi_data_c2h_00
set_property -dict [list \
  CONFIG.ADDR_WIDTH 39 \
  CONFIG.ARUSER_WIDTH 0 \
  CONFIG.AWUSER_WIDTH 0 \
  CONFIG.BUSER_WIDTH 0 \
  CONFIG.DATA_WIDTH 512 \
  CONFIG.HAS_BRESP 1 \
  CONFIG.HAS_BURST 1 \
  CONFIG.HAS_CACHE 0 \
  CONFIG.HAS_LOCK 0 \
  CONFIG.HAS_PROT 0 \
  CONFIG.HAS_QOS 0 \
  CONFIG.HAS_REGION 0 \
  CONFIG.HAS_RRESP 1 \
  CONFIG.HAS_WSTRB 1 \
  CONFIG.ID_WIDTH 2 \
  CONFIG.MAX_BURST_LENGTH 256 \
  CONFIG.NUM_READ_OUTSTANDING 64 \
  CONFIG.NUM_READ_THREADS 2 \
  CONFIG.NUM_WRITE_OUTSTANDING 32 \
  CONFIG.NUM_WRITE_THREADS 2 \
  CONFIG.PROTOCOL AXI4 \
  CONFIG.READ_WRITE_MODE READ_WRITE \
  CONFIG.REG_AR 0 \
  CONFIG.REG_AW 0 \
  CONFIG.REG_B 0 \
  CONFIG.REG_R 0 \
  CONFIG.REG_W 0 \
  CONFIG.RUSER_BITS_PER_BYTE 0 \
  CONFIG.RUSER_WIDTH 0 \
  CONFIG.SUPPORTS_NARROW_BURST 0 \
  CONFIG.WUSER_BITS_PER_BYTE 0 \
  CONFIG.WUSER_WIDTH 0 \
] [get_bd_cells m_ip_axi_data_c2h_00]
create_bd_cell -type ip -vlnv xilinx.com:ip:axi_register_slice:2.1 s_ip_axi_data_h2c_00
set_property -dict [list \
  CONFIG.ADDR_WIDTH 39 \
  CONFIG.ARUSER_WIDTH 0 \
  CONFIG.AWUSER_WIDTH 0 \
  CONFIG.BUSER_WIDTH 0 \
  CONFIG.DATA_WIDTH 512 \
  CONFIG.HAS_BRESP 1 \
  CONFIG.HAS_BURST 0 \
  CONFIG.HAS_CACHE 0 \
  CONFIG.HAS_LOCK 0 \
  CONFIG.HAS_PROT 0 \
  CONFIG.HAS_QOS 0 \
  CONFIG.HAS_REGION 0 \
  CONFIG.HAS_RRESP 1 \
  CONFIG.HAS_WSTRB 1 \
  CONFIG.ID_WIDTH 4 \
  CONFIG.MAX_BURST_LENGTH 64 \
  CONFIG.NUM_READ_OUTSTANDING 16 \
  CONFIG.NUM_READ_THREADS 2 \
  CONFIG.NUM_WRITE_OUTSTANDING 32 \
  CONFIG.NUM_WRITE_THREADS 2 \
  CONFIG.PROTOCOL AXI4 \
  CONFIG.READ_WRITE_MODE READ_WRITE \
  CONFIG.REG_AR 0 \
  CONFIG.REG_AW 0 \
  CONFIG.REG_B 0 \
  CONFIG.REG_R 0 \
  CONFIG.REG_W 0 \
  CONFIG.RUSER_BITS_PER_BYTE 0 \
  CONFIG.RUSER_WIDTH 0 \
  CONFIG.SUPPORTS_NARROW_BURST 0 \
  CONFIG.WUSER_BITS_PER_BYTE 0 \
  CONFIG.WUSER_WIDTH 0 \
] [get_bd_cells s_ip_axi_data_h2c_00]
create_bd_cell -type ip -vlnv xilinx.com:ip:axi_register_slice:2.1 m_ip_axi_data_h2c_00
set_property -dict [list \
  CONFIG.ADDR_WIDTH 39 \
  CONFIG.ARUSER_WIDTH 0 \
  CONFIG.AWUSER_WIDTH 0 \
  CONFIG.BUSER_WIDTH 0 \
  CONFIG.DATA_WIDTH 512 \
  CONFIG.HAS_BRESP 1 \
  CONFIG.HAS_BURST 0 \
  CONFIG.HAS_CACHE 0 \
  CONFIG.HAS_LOCK 0 \
  CONFIG.HAS_PROT 0 \
  CONFIG.HAS_QOS 0 \
  CONFIG.HAS_REGION 0 \
  CONFIG.HAS_RRESP 1 \
  CONFIG.HAS_WSTRB 1 \
  CONFIG.ID_WIDTH 4 \
  CONFIG.MAX_BURST_LENGTH 64 \
  CONFIG.NUM_READ_OUTSTANDING 16 \
  CONFIG.NUM_READ_THREADS 2 \
  CONFIG.NUM_WRITE_OUTSTANDING 32 \
  CONFIG.NUM_WRITE_THREADS 2 \
  CONFIG.PROTOCOL AXI4 \
  CONFIG.READ_WRITE_MODE READ_WRITE \
  CONFIG.REG_AR 0 \
  CONFIG.REG_AW 0 \
  CONFIG.REG_B 0 \
  CONFIG.REG_R 0 \
  CONFIG.REG_W 0 \
  CONFIG.RUSER_BITS_PER_BYTE 0 \
  CONFIG.RUSER_WIDTH 0 \
  CONFIG.SUPPORTS_NARROW_BURST 0 \
  CONFIG.WUSER_BITS_PER_BYTE 0 \
  CONFIG.WUSER_WIDTH 0 \
] [get_bd_cells m_ip_axi_data_h2c_00]
create_bd_cell -type ip -vlnv xilinx.com:ip:pipeline_reg:1.0 ip_data_satellite_ctrl_data_00
set_property -dict {CONFIG.DEPTH 0 CONFIG.WIDTH 4} [get_bd_cells ip_data_satellite_ctrl_data_00]
create_bd_cell -type ip -vlnv xilinx.com:ip:pipeline_reg:1.0 ip_data_memory_calib_complete_00
set_property -dict {CONFIG.DEPTH 0 CONFIG.WIDTH 1} [get_bd_cells ip_data_memory_calib_complete_00]
create_bd_cell -type ip -vlnv xilinx.com:ip:pipeline_reg:1.0 ip_data_hbm_temp_00
set_property -dict {CONFIG.DEPTH 0 CONFIG.WIDTH 7} [get_bd_cells ip_data_hbm_temp_00]
create_bd_cell -type ip -vlnv xilinx.com:ip:pipeline_reg:1.0 ip_data_hbm_temp_01
set_property -dict {CONFIG.DEPTH 0 CONFIG.WIDTH 7} [get_bd_cells ip_data_hbm_temp_01]
create_bd_cell -type ip -vlnv xilinx.com:ip:pipeline_reg:1.0 ip_irq_cu_00
set_property -dict {CONFIG.DEPTH 0 CONFIG.WIDTH 128} [get_bd_cells ip_irq_cu_00]
create_bd_cell -type ip -vlnv xilinx.com:ip:pipeline_reg:1.0 ip_irq_hbm_cattrip_00
set_property -dict {CONFIG.DEPTH 0 CONFIG.WIDTH 1} [get_bd_cells ip_irq_hbm_cattrip_00]

# ---- connections ----

connect_bd_intf_net -intf_net BLP_S_AXI_CTRL_MGMT_00_1 [get_bd_intf_pins s_ip_axi_ctrl_mgmt_00/S_AXI] [get_bd_intf_ports BLP_S_AXI_CTRL_MGMT_00]
connect_bd_intf_net -intf_net BLP_S_AXI_CTRL_MGMT_01_1 [get_bd_intf_pins s_ip_axi_ctrl_mgmt_01/S_AXI] [get_bd_intf_ports BLP_S_AXI_CTRL_MGMT_01]
connect_bd_intf_net -intf_net BLP_S_AXI_CTRL_USER_00_1 [get_bd_intf_pins s_ip_axi_ctrl_user_00/S_AXI] [get_bd_intf_ports BLP_S_AXI_CTRL_USER_00]
connect_bd_intf_net -intf_net BLP_S_AXI_CTRL_USER_01_1 [get_bd_intf_pins s_ip_axi_ctrl_user_01/S_AXI] [get_bd_intf_ports BLP_S_AXI_CTRL_USER_01]
connect_bd_intf_net -intf_net BLP_S_AXI_CTRL_USER_02_1 [get_bd_intf_pins s_ip_axi_ctrl_user_02/S_AXI] [get_bd_intf_ports BLP_S_AXI_CTRL_USER_02]
connect_bd_intf_net -intf_net BLP_S_AXI_CTRL_USER_03_1 [get_bd_intf_pins s_ip_axi_ctrl_user_03/S_AXI] [get_bd_intf_ports BLP_S_AXI_CTRL_USER_03]
connect_bd_intf_net -intf_net BLP_S_AXI_DATA_H2C_00_1 [get_bd_intf_pins s_ip_axi_data_h2c_00/S_AXI] [get_bd_intf_ports BLP_S_AXI_DATA_H2C_00]
connect_bd_intf_net -intf_net ULP_S_AXI_DATA_C2H_00_1 [get_bd_intf_pins s_ip_axi_data_c2h_00/S_AXI] [get_bd_intf_ports ULP_S_AXI_DATA_C2H_00]
connect_bd_intf_net [get_bd_intf_pins m_ip_axi_ctrl_mgmt_00/M_AXI] [get_bd_intf_ports ULP_M_AXI_CTRL_MGMT_00]
connect_bd_intf_net [get_bd_intf_pins m_ip_axi_ctrl_mgmt_01/M_AXI] [get_bd_intf_ports ULP_M_AXI_CTRL_MGMT_01]
connect_bd_intf_net [get_bd_intf_pins m_ip_axi_ctrl_user_00/M_AXI] [get_bd_intf_ports ULP_M_AXI_CTRL_USER_00]
connect_bd_intf_net [get_bd_intf_pins m_ip_axi_ctrl_user_01/M_AXI] [get_bd_intf_ports ULP_M_AXI_CTRL_USER_01]
connect_bd_intf_net [get_bd_intf_pins m_ip_axi_ctrl_user_02/M_AXI] [get_bd_intf_ports ULP_M_AXI_CTRL_USER_02]
connect_bd_intf_net [get_bd_intf_pins m_ip_axi_ctrl_user_03/M_AXI] [get_bd_intf_ports ULP_M_AXI_CTRL_USER_03]
connect_bd_intf_net [get_bd_intf_pins m_ip_axi_data_c2h_00/M_AXI] [get_bd_intf_ports BLP_M_AXI_DATA_C2H_00]
connect_bd_intf_net [get_bd_intf_pins m_ip_axi_data_h2c_00/M_AXI] [get_bd_intf_ports ULP_M_AXI_DATA_H2C_00]
connect_bd_intf_net [get_bd_intf_pins s_ip_axi_ctrl_mgmt_00/M_AXI] [get_bd_intf_pins m_ip_axi_ctrl_mgmt_00/S_AXI]
connect_bd_intf_net [get_bd_intf_pins s_ip_axi_ctrl_mgmt_01/M_AXI] [get_bd_intf_pins m_ip_axi_ctrl_mgmt_01/S_AXI]
connect_bd_intf_net [get_bd_intf_pins s_ip_axi_ctrl_user_00/M_AXI] [get_bd_intf_pins m_ip_axi_ctrl_user_00/S_AXI]
connect_bd_intf_net [get_bd_intf_pins s_ip_axi_ctrl_user_01/M_AXI] [get_bd_intf_pins m_ip_axi_ctrl_user_01/S_AXI]
connect_bd_intf_net [get_bd_intf_pins s_ip_axi_ctrl_user_02/M_AXI] [get_bd_intf_pins m_ip_axi_ctrl_user_02/S_AXI]
connect_bd_intf_net [get_bd_intf_pins s_ip_axi_ctrl_user_03/M_AXI] [get_bd_intf_pins m_ip_axi_ctrl_user_03/S_AXI]
connect_bd_intf_net [get_bd_intf_pins s_ip_axi_data_c2h_00/M_AXI] [get_bd_intf_pins m_ip_axi_data_c2h_00/S_AXI]
connect_bd_intf_net [get_bd_intf_pins s_ip_axi_data_h2c_00/M_AXI] [get_bd_intf_pins m_ip_axi_data_h2c_00/S_AXI]
connect_bd_net -net blp_s_aclk_ctrl_00_1 [get_bd_ports blp_s_aclk_ctrl_00] \
  [get_bd_pins ip_aclk_ctrl_00/clk_in] [get_bd_pins ip_aresetn_ctrl_00/clk] [get_bd_pins s_ip_axi_ctrl_mgmt_00/aclk] \
  [get_bd_pins s_ip_axi_ctrl_mgmt_01/aclk] [get_bd_pins s_ip_axi_ctrl_user_03/aclk] \
  [get_bd_pins ip_data_satellite_ctrl_data_00/clk]
connect_bd_net -net blp_s_aclk_freerun_ref_00_1 [get_bd_ports blp_s_aclk_freerun_ref_00] [get_bd_pins ip_aclk_freerun_ref_00/clk_in]
connect_bd_net -net blp_s_aclk_pcie_00_1 [get_bd_ports blp_s_aclk_pcie_00] \
  [get_bd_pins ip_aclk_pcie_00/clk_in] [get_bd_pins ip_aresetn_pcie_00/clk] [get_bd_pins s_ip_axi_ctrl_user_00/aclk] \
  [get_bd_pins s_ip_axi_ctrl_user_01/aclk] [get_bd_pins s_ip_axi_ctrl_user_02/aclk] [get_bd_pins m_ip_axi_data_c2h_00/aclk] \
  [get_bd_pins s_ip_axi_data_h2c_00/aclk]
connect_bd_net -net blp_s_aresetn_ctrl_00_1 [get_bd_ports blp_s_aresetn_ctrl_00] \
  [get_bd_pins ip_aresetn_ctrl_00/d] [get_bd_pins s_ip_axi_ctrl_mgmt_00/aresetn] [get_bd_pins s_ip_axi_ctrl_mgmt_01/aresetn] \
  [get_bd_pins s_ip_axi_ctrl_user_03/aresetn] [get_bd_pins ip_data_satellite_ctrl_data_00/resetn]
connect_bd_net -net blp_s_aresetn_pcie_00_1 [get_bd_ports blp_s_aresetn_pcie_00] \
  [get_bd_pins ip_aresetn_pcie_00/d] [get_bd_pins s_ip_axi_ctrl_user_00/aresetn] [get_bd_pins s_ip_axi_ctrl_user_01/aresetn] \
  [get_bd_pins s_ip_axi_ctrl_user_02/aresetn] [get_bd_pins m_ip_axi_data_c2h_00/aresetn] \
  [get_bd_pins s_ip_axi_data_h2c_00/aresetn]
connect_bd_net -net blp_s_data_satellite_ctrl_data_00_1 [get_bd_ports blp_s_data_satellite_ctrl_data_00] \
  [get_bd_pins ip_data_satellite_ctrl_data_00/d]
connect_bd_net [get_bd_pins ip_aclk_ctrl_00/clk_out] \
  [get_bd_ports ulp_m_aclk_ctrl_00] [get_bd_pins m_ip_axi_ctrl_mgmt_00/aclk] [get_bd_pins m_ip_axi_ctrl_mgmt_01/aclk] \
  [get_bd_pins m_ip_axi_ctrl_user_03/aclk] [get_bd_pins ip_data_memory_calib_complete_00/clk] \
  [get_bd_pins ip_data_hbm_temp_00/clk] [get_bd_pins ip_data_hbm_temp_01/clk] [get_bd_pins ip_irq_hbm_cattrip_00/clk]
connect_bd_net [get_bd_pins ip_aclk_freerun_ref_00/clk_out] [get_bd_ports ulp_m_aclk_freerun_ref_00]
connect_bd_net [get_bd_pins ip_aclk_pcie_00/clk_out] \
  [get_bd_ports ulp_m_aclk_pcie_00] [get_bd_pins m_ip_axi_ctrl_user_00/aclk] [get_bd_pins m_ip_axi_ctrl_user_01/aclk] \
  [get_bd_pins m_ip_axi_ctrl_user_02/aclk] [get_bd_pins s_ip_axi_data_c2h_00/aclk] [get_bd_pins m_ip_axi_data_h2c_00/aclk] \
  [get_bd_pins ip_irq_cu_00/clk]
connect_bd_net [get_bd_pins ip_aresetn_ctrl_00/q] \
  [get_bd_ports ulp_m_aresetn_ctrl_00] [get_bd_pins m_ip_axi_ctrl_mgmt_00/aresetn] \
  [get_bd_pins m_ip_axi_ctrl_mgmt_01/aresetn] [get_bd_pins m_ip_axi_ctrl_user_03/aresetn] \
  [get_bd_pins ip_data_memory_calib_complete_00/resetn] [get_bd_pins ip_data_hbm_temp_00/resetn] \
  [get_bd_pins ip_data_hbm_temp_01/resetn] [get_bd_pins ip_irq_hbm_cattrip_00/resetn]
connect_bd_net [get_bd_pins ip_aresetn_pcie_00/q] \
  [get_bd_ports ulp_m_aresetn_pcie_00] [get_bd_pins m_ip_axi_ctrl_user_00/aresetn] \
  [get_bd_pins m_ip_axi_ctrl_user_01/aresetn] [get_bd_pins m_ip_axi_ctrl_user_02/aresetn] \
  [get_bd_pins s_ip_axi_data_c2h_00/aresetn] [get_bd_pins m_ip_axi_data_h2c_00/aresetn] [get_bd_pins ip_irq_cu_00/resetn]
connect_bd_net [get_bd_pins ip_data_hbm_temp_00/q] [get_bd_ports blp_m_data_hbm_temp_00]
connect_bd_net [get_bd_pins ip_data_hbm_temp_01/q] [get_bd_ports blp_m_data_hbm_temp_01]
connect_bd_net [get_bd_pins ip_data_memory_calib_complete_00/q] [get_bd_ports blp_m_data_memory_calib_complete_00]
connect_bd_net [get_bd_pins ip_data_satellite_ctrl_data_00/q] [get_bd_ports ulp_m_data_satellite_ctrl_data_00]
connect_bd_net [get_bd_pins ip_irq_cu_00/q] [get_bd_ports blp_m_irq_cu_00]
connect_bd_net [get_bd_pins ip_irq_hbm_cattrip_00/q] [get_bd_ports blp_m_irq_hbm_cattrip_00]
connect_bd_net -net ulp_s_data_hbm_temp_00_1 [get_bd_ports ulp_s_data_hbm_temp_00] [get_bd_pins ip_data_hbm_temp_00/d]
connect_bd_net -net ulp_s_data_hbm_temp_01_1 [get_bd_ports ulp_s_data_hbm_temp_01] [get_bd_pins ip_data_hbm_temp_01/d]
connect_bd_net -net ulp_s_data_memory_calib_complete_00_1 [get_bd_ports ulp_s_data_memory_calib_complete_00] \
  [get_bd_pins ip_data_memory_calib_complete_00/d]
connect_bd_net -net ulp_s_irq_cu_00_1 [get_bd_ports ulp_s_irq_cu_00] [get_bd_pins ip_irq_cu_00/d]
connect_bd_net -net ulp_s_irq_hbm_cattrip_00_1 [get_bd_ports ulp_s_irq_hbm_cattrip_00] [get_bd_pins ip_irq_hbm_cattrip_00/d]

validate_bd_design
save_bd_design
